# Altium project water_pwr.PrjPcb
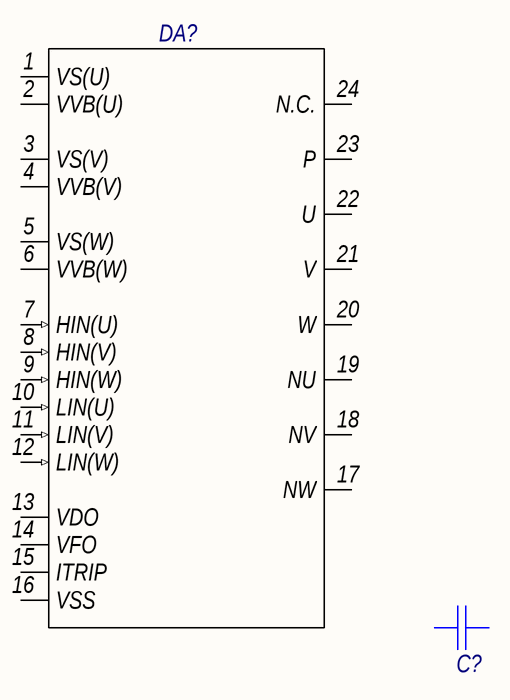
[diagram p0: Power.SchDoc]
CompanyName: ASVM; GlobalOrganisationName: ASVM
1 sheet, 2 parts. Net scope: global (net labels, ports and power ports of the same name join across sheets).

## Sheet Power.SchDoc
size 410 x 297 mm; PageSetup: Record=PageOptions|CenterHorizontal=True|CenterVertical=True|PrintScale=1.00|XCorrection=1.00|YCorrection=1.00|PrintKind=1|BorderSize=5000000|LeftOffset=0|BottomOffset=0|Orientation=2|PaperLength=1000|PaperWidth=1000|Scale=100|PaperSource=15|PrintQuality=1200|MediaType=1|DitherType=10|PaperKind=A3|PrintScaleMode=1; Weight: -; ScaleFactor: -; NormInspection: Норм.Контр.

### Parts
C?  Capacitor  [k73-17-22_5mm]  (value not drawn)
DA?  IKCM15F60GA  [INF-CIPOS MINI]  (value not drawn)

### Nets

Not connected (* = marked no-connect by the designer): C? 1 2; DA? 1(VS(U)) 2(VVB(U)) 3(VS(V)) 4(VVB(V)) 5(VS(W)) 6(VVB(W)) 7(HIN(U)) 8(HIN(V)) 9(HIN(W)) 10(LIN(U)) 11(LIN(V)) 12(LIN(W)) 13(VDO) 14(VFO) 15(ITRIP) 16(VSS) 17(NW) 18(NV) 19(NU) 20(W) 21(V) 22(U) 23(P) 24(N.C.)

### Notes on the sheet
- Перв. примен.
- Справ. №
- Подп. и дата
- Инв. № дубл.
- Взам. инв. №
- Разраб.
- Изм.
- Лист
- № докум.
- Подп.
- Дата
- Литера
- Масса
- Масштаб
- Пров.
- Т.контр.
- Листов
- Инв. № подл.
- Н.контр.
- Утв.
- Форма 1 ГОСТ 2.104-2006
- Копировал
- Формат А3

### Library data of the parts
C? = GRM21BR61E226ME44L: Manufacturer: Murata; Type: Конденсатор; ID: 39; Value: 22uF; Voltage: 25V; Tolerance: ±20%; Dielectric Type: X5R; Published: 18.05.2010; Publisher: Andrew Danich; Part Number: GRM21BR61E226ME44L; Footprint: 0805
DA? = IKCM15F60GA: IGBT module